# Altium project YYB.PrjPcb
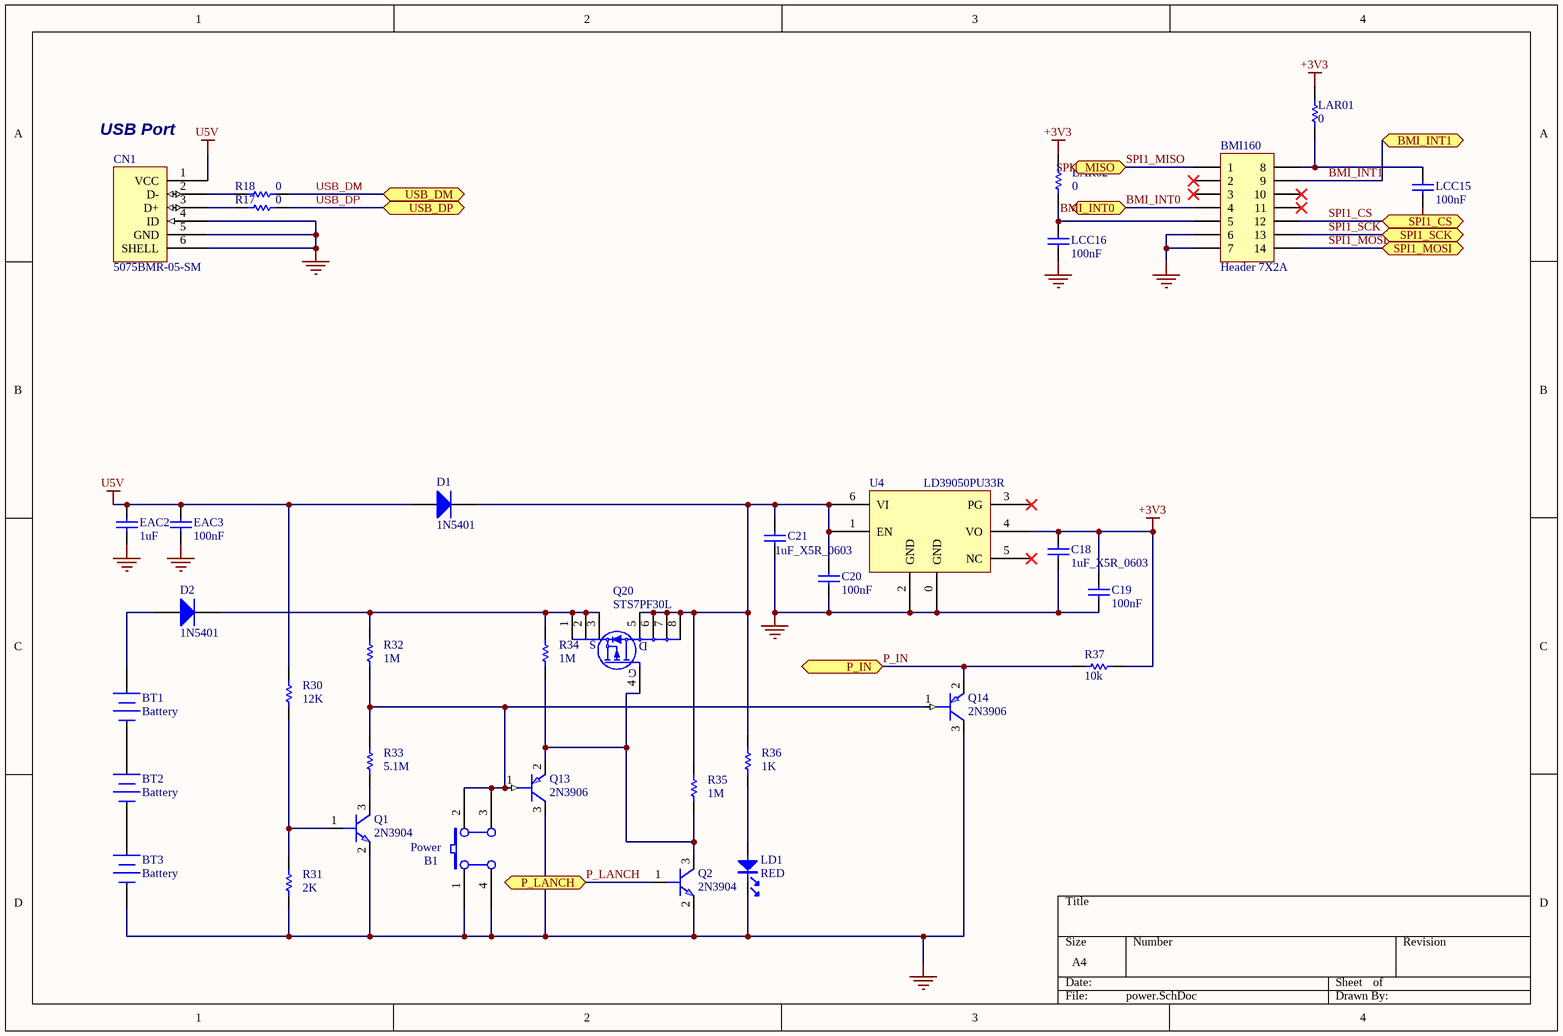
[diagram p0: power.SchDoc]
3 sheets, 145 parts. Net scope: flat (ports and power ports of the same name join across sheets).
Board file: YYB.PcbDoc
Sheets:
  power.SchDoc
  Leds.SchDoc
  MCU_64.SchDoc

## Sheet power.SchDoc
size A4

### Parts
B1  Power  [PB10]
BMI160  Header 7X2A  [BMI160]
BT1  Battery  [BAT]
BT2  Battery  [BAT]
BT3  Battery  [BAT]
C18  1uF_X5R_0603  [0603C]
C19  100nF  [0603C]
C20  100nF  [0603C]
C21  1uF_X5R_0603  [0603C]
CN1  5075BMR-05-SM  [USB-MINI-B-SMD]
D1  1N5401  [SMA]
D2  1N5401  [SMA]
EAC2  1uF  [0603C]
EAC3  100nF  [0603C]
LAR01  0  [0603R]
LAR02  0  [0603R]
LCC15  100nF  [0603C]
LCC16  100nF  [0603C]
LD1  RED  [0603D]
Q1  2N3904  [SOT-23]
Q2  2N3904  [SOT-23]
Q13  2N3906  [SOT-23]
Q14  2N3906  [SOT-23]
Q20  STS7PF30L  [SO8]
R17  0  [0603R]
R18  0  [0603R]
R30  12K  [0603R]
R31  2K  [0603R]
R32  1M  [0603R]
R33  5.1M  [0603R]
R34  1M  [0603R]
R35  1M  [0603R]
R36  1K  [0603R]
R37  10k  [0603R]
U4  LD39050PU33R  [DFN6(3X3)]

### Ports
BMI_INT0 (bidir), BMI_INT1 (bidir), P_IN (bidir), P_LANCH, SPI1_CS (bidir), SPI1_MISO (bidir), SPI1_MOSI (bidir), SPI1_SCK (bidir), USB_DM (bidir), USB_DP (bidir)

### Nets
+3V3: C18.1 C19.2 LAR01.2 LAR02.2 R37.1 U4.4(VO)
GND: B1.1(A0) B1.4(A1) BMI160.6 BMI160.7 BT3.2(-) C18.2 C19.1 C20.1 C21.2 CN1.4(ID) CN1.5(GND) CN1.6(SHELL) EAC2.2 EAC3.2 LCC15.1 LCC16.1 LD1.2 Q1.2(E) Q2.2(E) Q13.3(COLLECTOR) Q14.3(COLLECTOR) R31.1 U4.0(GND) U4.2(GND)
U5V: CN1.1(VCC) D1.1(A) EAC2.1 EAC3.1 R30.2
BMI_INT0: BMI160.4 ; port BMI_INT0
BMI_INT1: BMI160.9 ; port BMI_INT1
P_IN: Q14.2(EMITTER) R37.2 ; port P_IN
P_LANCH: Q2.1(B) ; port P_LANCH
SPI1_CS: BMI160.12 ; port SPI1_CS  [project net PA4]
SPI1_MISO: BMI160.1 ; port SPI1_MISO  [project net PA6]
SPI1_MOSI: BMI160.14 ; port SPI1_MOSI  [project net PA7]
SPI1_SCK: BMI160.13 ; port SPI1_SCK  [project net PA5]
USB_DM: R18.2 ; port USB_DM  [project net PA11]
USB_DP: R17.2 ; port USB_DP  [project net PA12]
NetB1_2: B1.2(B0) B1.3(B1) Q13.1(BASE) Q14.1(BASE) R32.1 R33.2
NetBMI160_5: BMI160.5 LAR02.1 LCC16.2
NetBMI160_8: BMI160.8 LAR01.1 LCC15.2
NetBT1_1: BT1.1(+) D2.1(A)
NetBT1_2: BT1.2(-) BT2.1(+)
NetBT2_2: BT2.2(-) BT3.1(+)
NetC20_2: C20.2 C21.1 D1.2(K) Q20.5(D) Q20.6(D) Q20.7(D) Q20.8(D) R35.2 R36.2 U4.1(EN) U4.6(VI)
NetCN1_2: CN1.2(D-) R18.1
NetCN1_3: CN1.3(D+) R17.1
NetD2_2: D2.2(K) Q20.1(S) Q20.2(S) Q20.3(S) R32.2 R34.2
NetLD1_1: LD1.1 R36.1
NetQ1_1: Q1.1(B) R30.1 R31.2
NetQ1_3: Q1.3(C) R33.1
NetQ2_3: Q2.3(C) Q13.2(EMITTER) Q20.4(G) R34.1 R35.1

Not connected (* = marked no-connect by the designer): BMI160 2* 3* 10* 11*; U4 3(PG)* 5(NC)*

### Notes on the sheet
- (near CN1) USB Port

### Library data of the parts
B1 = SW PUSHBUTTON: SE PUSHBUTTON
BMI160 = Header 7X2A: Header, 7-Pin, Dual row; LatestRevisionDate: 17-Jul-2002; LatestRevisionNote: Re-released for DXP Platform.; Publisher: Altium Limited
BT1-BT3 = Battery: Multicell Battery; Published: 24-Mar-1999; LatestRevisionDate: 17-Jul-2002; LatestRevisionNote: Re-released for DXP Platform.; PackageReference: BAT-2; Publisher: Altium Limited; PackageDescription: Battery; 2 Leads
C18 C21 = CAP SMD 0603  X5R 1礔 25V 10%: 0603  X5R 1礔; Rated voltage: 25V; Tolerance: 10%; Manufacturer: *; Manufacturer P/N: *; Order code Farnell: 1288202RL; Value: 1礔; Power: *; Technology: X5R; Temperature  Factor: *; Temperature Max: +125癈; Temperature Min: -55癈; STS Code: *
C19 C20 = Capacitor_ST: Capacitor 0402 / 0603 / 0805; Revision: July-2002: Re-released for DXP Platform.; Value: 100nF
CN1 = USB-MINI-typeB connector: Manuf_Part_1: 5075BMR-05-SM; Order: 5075BMR-05-SM; ECCN: ????
D1 D2 = STPS2L30A: Manuf_1: STM; Provided: ST; Order: BAT60JFILM; ECCN_US/EU: EAR99/NEC; Revision: July-2002: Re-released for DXP Platform.; Manuf_Part_1: BAT60JFILM; Distrib: ST
EAC2 EAC3 LCC15 LCC16 = CAP: Capacitor; Value: 100pF; Published: 8-Jun-2000; Revision: July-2002: Re-released for DXP Platform.; Publisher: Altium Limited
LAR01 LAR02 = res1: Resistor; Value: 1K; Published: 8-Jun-2000; Revision: July-2002: Re-released for DXP Platform.; Publisher: Altium Limited
LD1 = PHOTO
Q1 Q2 = 2N5551: Text Field1: 20; Text Field2: 20
Q13 Q14 = 2N5401: Text Field1: 20; Text Field2: 20
R17 R18 R30-R36 = Resistor_ST: Resistor 0402 / 0603 / 0805; Value: 10K
R37 = Resistor_ST: Resistor 0402 / 0603 / 0805; Value: 10K
U4 = LD39050P

## Sheet Leds.SchDoc: Extension connectors
size A4; DocumentNumber: MB1136; Revision: C.3; SheetNumber: 4; SheetTotal: 4; Project: NUCLEO-XXXXRX
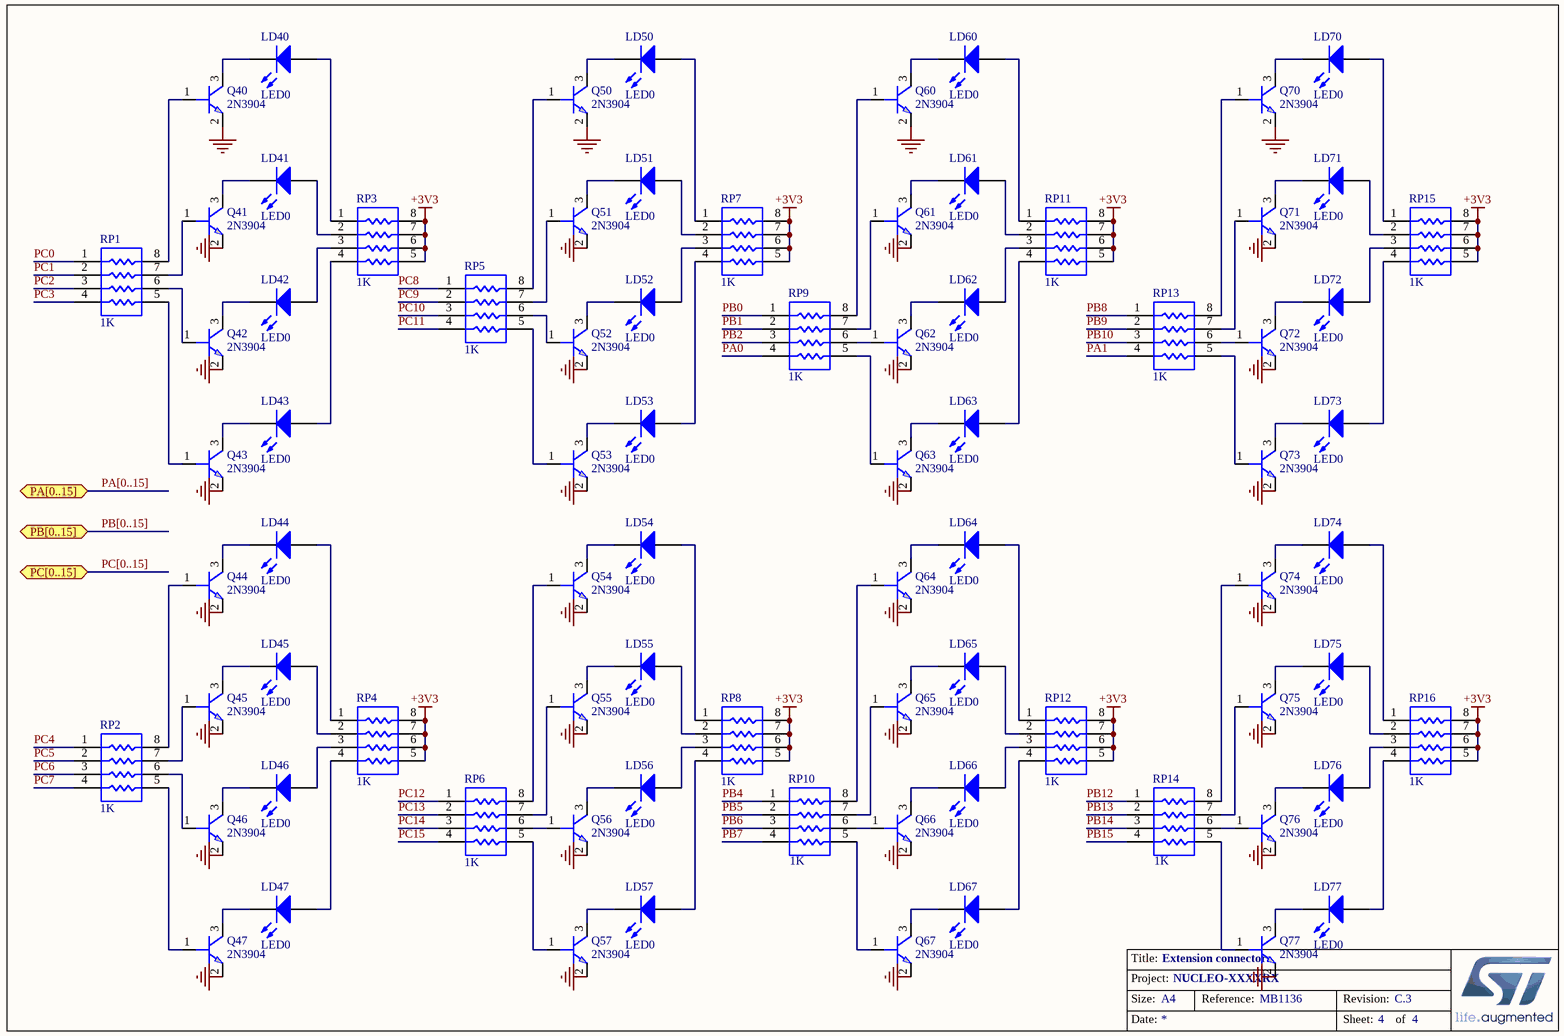
[diagram p1: Leds.SchDoc]

### Parts
LD40  LED0  [LED5]
LD41  LED0  [LED5]
LD42  LED0  [LED5]
LD43  LED0  [LED5]
LD44  LED0  [LED5]
LD45  LED0  [LED5]
LD46  LED0  [LED5]
LD47  LED0  [LED5]
LD50  LED0  [LED5]
LD51  LED0  [LED5]
LD52  LED0  [LED5]
LD53  LED0  [LED5]
LD54  LED0  [LED5]
LD55  LED0  [LED5]
LD56  LED0  [LED5]
LD57  LED0  [LED5]
LD60  LED0  [LED5]
LD61  LED0  [LED5]
LD62  LED0  [LED5]
LD63  LED0  [LED5]
LD64  LED0  [LED5]
LD65  LED0  [LED5]
LD66  LED0  [LED5]
LD67  LED0  [LED5]
LD70  LED0  [LED5]
LD71  LED0  [LED5]
LD72  LED0  [LED5]
LD73  LED0  [LED5]
LD74  LED0  [LED5]
LD75  LED0  [LED5]
LD76  LED0  [LED5]
LD77  LED0  [LED5]
Q40  2N3904  [SOT-23]
Q41  2N3904  [SOT-23]
Q42  2N3904  [SOT-23]
Q43  2N3904  [SOT-23]
Q44  2N3904  [SOT-23]
Q45  2N3904  [SOT-23]
Q46  2N3904  [SOT-23]
Q47  2N3904  [SOT-23]
Q50  2N3904  [SOT-23]
Q51  2N3904  [SOT-23]
Q52  2N3904  [SOT-23]
Q53  2N3904  [SOT-23]
Q54  2N3904  [SOT-23]
Q55  2N3904  [SOT-23]
Q56  2N3904  [SOT-23]
Q57  2N3904  [SOT-23]
Q60  2N3904  [SOT-23]
Q61  2N3904  [SOT-23]
Q62  2N3904  [SOT-23]
Q63  2N3904  [SOT-23]
Q64  2N3904  [SOT-23]
Q65  2N3904  [SOT-23]
Q66  2N3904  [SOT-23]
Q67  2N3904  [SOT-23]
Q70  2N3904  [SOT-23]
Q71  2N3904  [SOT-23]
Q72  2N3904  [SOT-23]
Q73  2N3904  [SOT-23]
Q74  2N3904  [SOT-23]
Q75  2N3904  [SOT-23]
Q76  2N3904  [SOT-23]
Q77  2N3904  [SOT-23]
RP1  1K  [4P8]
RP2  1K  [4P8]
RP3  1K  [4P8]
RP4  1K  [4P8]
RP5  1K  [4P8]
RP6  1K  [4P8]
RP7  1K  [4P8]
RP8  1K  [4P8]
RP9  1K  [4P8]
RP10  1K  [4P8]
RP11  1K  [4P8]
RP12  1K  [4P8]
RP13  1K  [4P8]
RP14  1K  [4P8]
RP15  1K  [4P8]
RP16  1K  [4P8]

### Ports
PA[0..15] (bidir), PB[0..15] (bidir), PC[0..15] (bidir)

### Nets
+3V3: RP3.5 RP3.6 RP3.7 RP3.8 RP4.5 RP4.6 RP4.7 RP4.8 RP7.5 RP7.6 RP7.7 RP7.8 RP8.5 RP8.6 RP8.7 RP8.8 RP11.5 RP11.6 RP11.7 RP11.8 RP12.5 RP12.6 RP12.7 RP12.8 RP15.5 RP15.6 RP15.7 RP15.8 RP16.5 RP16.6 RP16.7 RP16.8
GND: Q40.2(E) Q41.2(E) Q42.2(E) Q43.2(E) Q44.2(E) Q45.2(E) Q46.2(E) Q47.2(E) Q50.2(E) Q51.2(E) Q52.2(E) Q53.2(E) Q54.2(E) Q55.2(E) Q56.2(E) Q57.2(E) Q60.2(E) Q61.2(E) Q62.2(E) Q63.2(E) Q64.2(E) Q65.2(E) Q66.2(E) Q67.2(E) Q70.2(E) Q71.2(E) Q72.2(E) Q73.2(E) Q74.2(E) Q75.2(E) Q76.2(E) Q77.2(E)
PA0: RP9.4
PA1: RP13.4
PB0: RP9.1
PB1: RP9.2
PB2: RP9.3
PB4: RP10.1
PB5: RP10.2
PB6: RP10.3
PB7: RP10.4
PB8: RP13.1
PB9: RP13.2
PB10: RP13.3
PB12: RP14.1
PB13: RP14.2
PB14: RP14.3
PB15: RP14.4
PC0: RP1.1
PC1: RP1.2
PC2: RP1.3
PC3: RP1.4
PC4: RP2.1
PC5: RP2.2
PC6: RP2.3
PC7: RP2.4
PC8: RP5.1
PC9: RP5.2
PC10: RP5.3
PC11: RP5.4
PC12: RP6.1
PC13: RP6.2
PC14: RP6.3
PC15: RP6.4
NetLD40_1: LD40.1(A) RP3.1
NetLD40_2: LD40.2(K) Q40.3(C)
NetLD41_1: LD41.1(A) RP3.2
NetLD41_2: LD41.2(K) Q41.3(C)
NetLD42_1: LD42.1(A) RP3.3
NetLD42_2: LD42.2(K) Q42.3(C)
NetLD43_1: LD43.1(A) RP3.4
NetLD43_2: LD43.2(K) Q43.3(C)
NetLD44_1: LD44.1(A) RP4.1
NetLD44_2: LD44.2(K) Q44.3(C)
NetLD45_1: LD45.1(A) RP4.2
NetLD45_2: LD45.2(K) Q45.3(C)
NetLD46_1: LD46.1(A) RP4.3
NetLD46_2: LD46.2(K) Q46.3(C)
NetLD47_1: LD47.1(A) RP4.4
NetLD47_2: LD47.2(K) Q47.3(C)
NetLD50_1: LD50.1(A) RP7.1
NetLD50_2: LD50.2(K) Q50.3(C)
NetLD51_1: LD51.1(A) RP7.2
NetLD51_2: LD51.2(K) Q51.3(C)
NetLD52_1: LD52.1(A) RP7.3
NetLD52_2: LD52.2(K) Q52.3(C)
NetLD53_1: LD53.1(A) RP7.4
NetLD53_2: LD53.2(K) Q53.3(C)
NetLD54_1: LD54.1(A) RP8.1
NetLD54_2: LD54.2(K) Q54.3(C)
NetLD55_1: LD55.1(A) RP8.2
NetLD55_2: LD55.2(K) Q55.3(C)
NetLD56_1: LD56.1(A) RP8.3
NetLD56_2: LD56.2(K) Q56.3(C)
NetLD57_1: LD57.1(A) RP8.4
NetLD57_2: LD57.2(K) Q57.3(C)
NetLD60_1: LD60.1(A) RP11.1
NetLD60_2: LD60.2(K) Q60.3(C)
NetLD61_1: LD61.1(A) RP11.2
NetLD61_2: LD61.2(K) Q61.3(C)
NetLD62_1: LD62.1(A) RP11.3
NetLD62_2: LD62.2(K) Q62.3(C)
NetLD63_1: LD63.1(A) RP11.4
NetLD63_2: LD63.2(K) Q63.3(C)
NetLD64_1: LD64.1(A) RP12.1
NetLD64_2: LD64.2(K) Q64.3(C)
NetLD65_1: LD65.1(A) RP12.2
NetLD65_2: LD65.2(K) Q65.3(C)
NetLD66_1: LD66.1(A) RP12.3
NetLD66_2: LD66.2(K) Q66.3(C)
NetLD67_1: LD67.1(A) RP12.4
NetLD67_2: LD67.2(K) Q67.3(C)
NetLD70_1: LD70.1(A) RP15.1
NetLD70_2: LD70.2(K) Q70.3(C)
NetLD71_1: LD71.1(A) RP15.2
NetLD71_2: LD71.2(K) Q71.3(C)
NetLD72_1: LD72.1(A) RP15.3
NetLD72_2: LD72.2(K) Q72.3(C)
NetLD73_1: LD73.1(A) RP15.4
NetLD73_2: LD73.2(K) Q73.3(C)
NetLD74_1: LD74.1(A) RP16.1
NetLD74_2: LD74.2(K) Q74.3(C)
NetLD75_1: LD75.1(A) RP16.2
NetLD75_2: LD75.2(K) Q75.3(C)
NetLD76_1: LD76.1(A) RP16.3
NetLD76_2: LD76.2(K) Q76.3(C)
NetLD77_1: LD77.1(A) RP16.4
NetLD77_2: LD77.2(K) Q77.3(C)
NetQ40_1: Q40.1(B) RP1.8
NetQ41_1: Q41.1(B) RP1.7
NetQ42_1: Q42.1(B) RP1.6
NetQ43_1: Q43.1(B) RP1.5
NetQ44_1: Q44.1(B) RP2.8
NetQ45_1: Q45.1(B) RP2.7
NetQ46_1: Q46.1(B) RP2.6
NetQ47_1: Q47.1(B) RP2.5
NetQ50_1: Q50.1(B) RP5.8
NetQ51_1: Q51.1(B) RP5.7
NetQ52_1: Q52.1(B) RP5.6
NetQ53_1: Q53.1(B) RP5.5
NetQ54_1: Q54.1(B) RP6.8
NetQ55_1: Q55.1(B) RP6.7
NetQ56_1: Q56.1(B) RP6.6
NetQ57_1: Q57.1(B) RP6.5
NetQ60_1: Q60.1(B) RP9.8
NetQ61_1: Q61.1(B) RP9.7
NetQ62_1: Q62.1(B) RP9.6
NetQ63_1: Q63.1(B) RP9.5
NetQ64_1: Q64.1(B) RP10.8
NetQ65_1: Q65.1(B) RP10.7
NetQ66_1: Q66.1(B) RP10.6
NetQ67_1: Q67.1(B) RP10.5
NetQ70_1: Q70.1(B) RP13.8
NetQ71_1: Q71.1(B) RP13.7
NetQ72_1: Q72.1(B) RP13.6
NetQ73_1: Q73.1(B) RP13.5
NetQ74_1: Q74.1(B) RP14.8
NetQ75_1: Q75.1(B) RP14.7
NetQ76_1: Q76.1(B) RP14.6
NetQ77_1: Q77.1(B) RP14.5

### Buses and harness runs
bus PA[0..15] = port PA[0..15]
bus PB[0..15] = port PB[0..15]
bus PC[0..15] = port PC[0..15]

### Notes on the sheet
- Title:
- Project:
- Size:
- Date:
- A4
- Reference:
- Sheet:
- Revision:
- of

### Library data of the parts
LD40-LD47 LD50-LD57 LD60-LD67 LD70-LD77 = LED0: Typical INFRARED GaAs LED; Published: 8-Jun-2000; LatestRevisionDate: 08-Jul-2005; LatestRevisionNote: Mech Layer 1 removed.; PackageReference: LED-0; Publisher: Altium Limited; PackageDescription: LED; 2 Leads
Q40-Q47 Q50-Q57 Q60-Q67 Q70-Q77 = 2N5551: Text Field1: 20; Text Field2: 20
RP1-RP16 = RESPACK3_1

## Sheet MCU_64.SchDoc: MCU
size A4; DocumentNumber: MB1136; Revision: C.3; SheetNumber: 2; SheetTotal: 4; Project: NUCLEO-XXXXRX
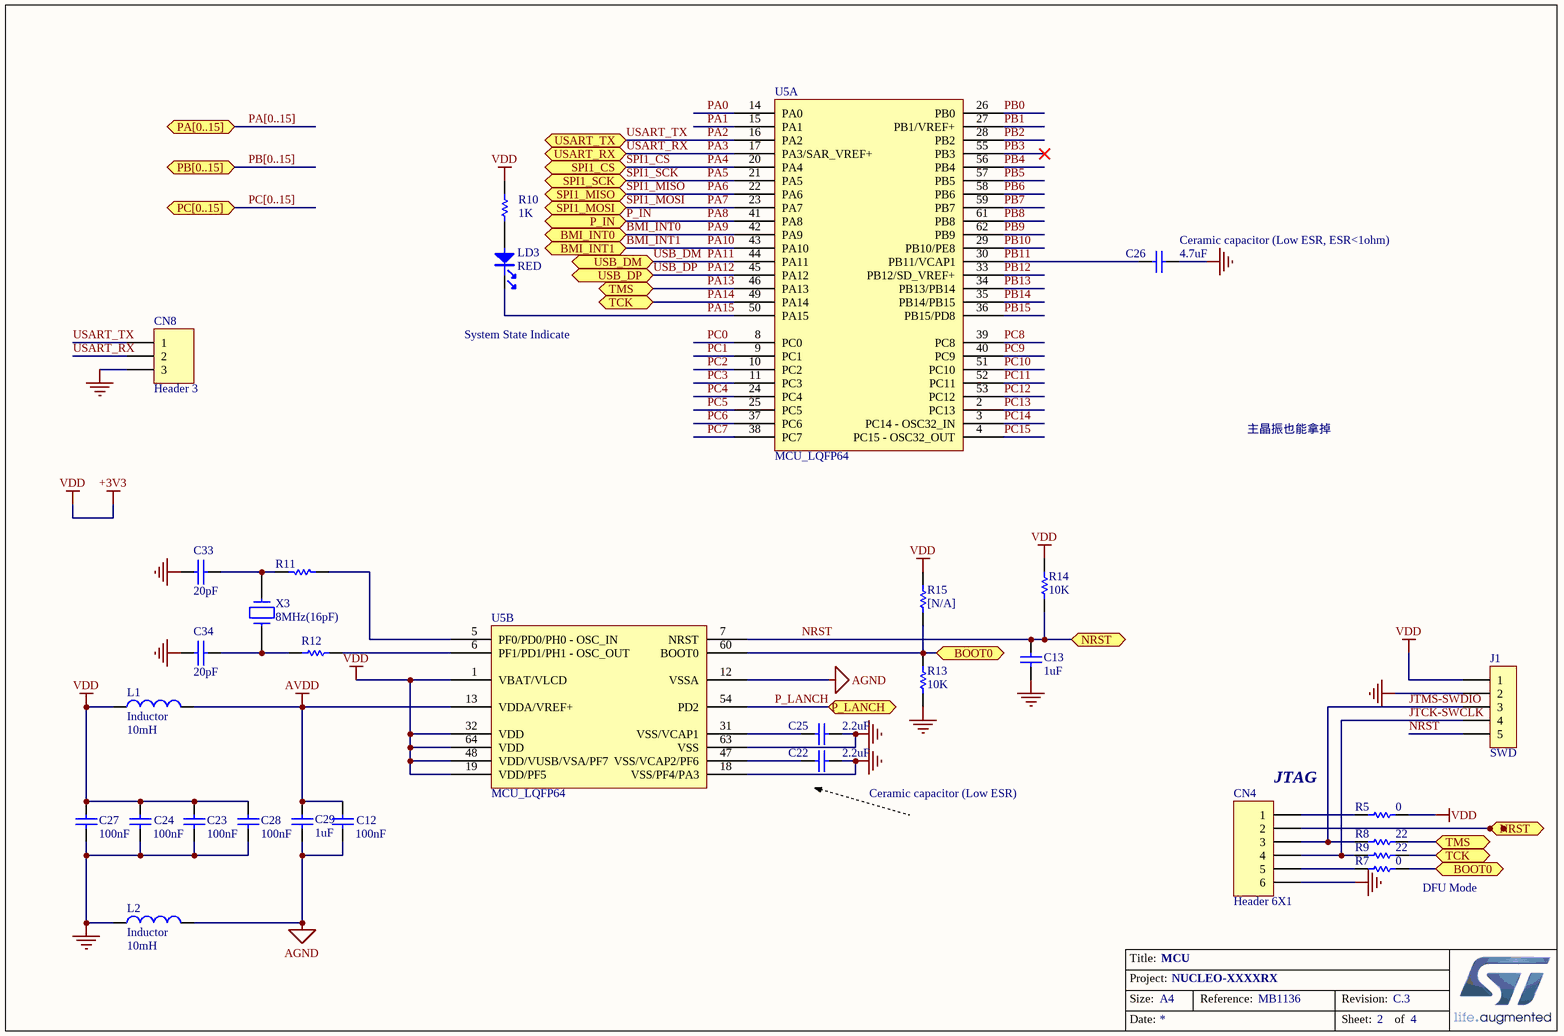
[diagram p2: MCU_64.SchDoc]

### Parts
C12  100nF  [0603C]
C13  1uF  [0603C]
C22  2.2uF  [C-0805]
C23  100nF  [0603C]
C24  100nF  [0603C]
C25  2.2uF  [C-0805]
C26  4.7uF  [C-0805]
C27  100nF  [0603C]
C28  100nF  [0603C]
C29  1uF  [0603C]
C33  20pF  [0603C]
C34  20pF  [0603C]
CN4  Header 6X1  [HDR1X6]
CN8  Header 3  [HDR1X3]
J1  SWD  [HDR1X5]
L1  Inductor  value 10mH  [0603R]
L2  Inductor  value 10mH  [0603R]
LD3  RED  [0603D]
R5  0  [0603R]
R7  0  [0603R]
R8  22  [0603R]
R9  22  [0603R]
R10  1K  [0603R]
R11  (no value)  [0603R]
R12  (no value)  [0603R]
R13  10K  [0603R]
R14  10K  [0603R]
R15  [N/A]  [0603R]
U5  MCU_LQFP64  [LQFP64]  (parts A,B of 2)
X3  8MHz(16pF)  [X-1105/A-JL]

### Ports
BMI_INT0 (bidir), BMI_INT1 (bidir), BOOT0, NRST, P_IN (bidir), P_LANCH, PA[0..15] (bidir), PB[0..15] (bidir), PC[0..15] (bidir), SPI1_CS (bidir), SPI1_MISO (bidir), SPI1_MOSI (bidir), SPI1_SCK (bidir), TCK, TMS, USART_RX (bidir), USART_TX (bidir), USB_DM (bidir), USB_DP (bidir)

### Nets
+3V3: C23.1 C24.1 C27.1 C28.1 J1.1 L1.1 R5.2 R10.2 R14.1 R15.1 U5.1(VBAT/VLCD) U5.19(VDD/PF5) U5.32(VDD) U5.48(VDD/VUSB/VSA/PF7) U5.64(VDD)  [also labelled VDD]
AGND: C12.2 C29.2 L2.2 U5.12(VSSA)
AVDD: C12.1 C29.1 L1.2 U5.13(VDDA/VREF+)
GND: C13.2 C22.2 C23.2 C24.2 C25.2 C26.2 C27.2 C28.2 C33.2 C34.2 CN4.6 CN8.3 J1.2 L2.1 R13.2 U5.18(VSS/PF4/PA3) U5.63(VSS)
BMI_INT0: U5.42(PA9) ; port BMI_INT0  [also labelled PA9]
BMI_INT1: U5.43(PA10) ; port BMI_INT1  [also labelled PA10]
JTCK-SWCLK: CN4.4 J1.4 R9.1
JTMS-SWDIO: CN4.3 J1.3 R8.1
NRST: C13.1 CN4.2 J1.5 R14.2 U5.7(NRST) ; port NRST
P_IN: U5.41(PA8) ; port P_IN  [also labelled PA8]
P_LANCH: U5.54(PD2) ; port P_LANCH
PA0: U5.14(PA0)
PA1: U5.15(PA1)
PA2: CN8.1 U5.16(PA2) ; port USART_TX  [also labelled USART_TX]
PA3: CN8.2 U5.17(PA3/SAR_VREF+) ; port USART_RX  [also labelled USART_RX]
PA4: U5.20(PA4) ; port SPI1_CS  [also labelled SPI1_CS]
PA5: U5.21(PA5) ; port SPI1_SCK  [also labelled SPI1_SCK]
PA6: U5.22(PA6) ; port SPI1_MISO  [also labelled SPI1_MISO]
PA7: U5.23(PA7) ; port SPI1_MOSI  [also labelled SPI1_MOSI]
PA11: U5.44(PA11) ; port USB_DM  [also labelled USB_DM]
PA12: U5.45(PA12) ; port USB_DP  [also labelled USB_DP]
PA13: R8.2 U5.46(PA13) ; port TMS
PA14: R9.2 U5.49(PA14) ; port TCK
PA15: LD3.2 U5.50(PA15)
PB0: U5.26(PB0)
PB1: U5.27(PB1/VREF+)
PB2: U5.28(PB2)
PB3: U5.55(PB3)
PB4: U5.56(PB4)
PB5: U5.57(PB5)
PB6: U5.58(PB6)
PB7: U5.59(PB7)
PB8: U5.61(PB8)
PB9: U5.62(PB9)
PB10: U5.29(PB10/PE8)
PB11: C26.1 U5.30(PB11/VCAP1)
PB12: U5.33(PB12/SD_VREF+)
PB13: U5.34(PB13/PB14)
PB14: U5.35(PB14/PB15)
PB15: U5.36(PB15/PD8)
PC0: U5.8(PC0)
PC1: U5.9(PC1)
PC2: U5.10(PC2)
PC3: U5.11(PC3)
PC4: U5.24(PC4)
PC5: U5.25(PC5)
PC6: U5.37(PC6)
PC7: U5.38(PC7)
PC8: U5.39(PC8)
PC9: U5.40(PC9)
PC10: U5.51(PC10)
PC11: U5.52(PC11)
PC12: U5.53(PC12)
PC13: U5.2(PC13)
PC14: U5.3(PC14_-_OSC32_IN)
PC15: U5.4(PC15_-_OSC32_OUT)
NetC22_1: C22.1 U5.47(VSS/VCAP2/PF6)
NetC25_1: C25.1 U5.31(VSS/VCAP1)
NetC33_1: C33.1 R11.2 X3.2
NetC34_1: C34.1 R12.2 X3.1
NetCN4_1: CN4.1 R5.1
NetCN4_5: CN4.5 R7.1
NetLD3_1: LD3.1 R10.1
NetR7_2: R7.2 R13.1 R15.2 U5.60(BOOT0) ; port BOOT0
NetR11_1: R11.1 U5.5(PF0/PD0/PH0_-_OSC_IN)
NetR12_1: R12.1 U5.6(PF1/PD1/PH1_-_OSC_OUT)

### Buses and harness runs
bus PA[0..15] = port PA[0..15]
bus PB[0..15] = port PB[0..15]
bus PC[0..15] = port PC[0..15]

### Notes on the sheet
- (near C26) Ceramic capacitor (Low ESR, ESR<1ohm)
- System State Indicate
- 主晶振也能拿掉
- (near CN4) JTAG
- Ceramic capacitor (Low ESR)
- DFU Mode
- Title:
- Project:
- Size:
- Date:
- A4
- Reference:
- Sheet:
- Revision:
- of

### Library data of the parts
C12 C23 C24 C27 C28 = Cap: Capacitor; Value: 10nF; Published: 8-Jun-2000; Revision: July-2002: Re-released for DXP Platform.; Publisher: Altium Limited
C13 C29 = CAP SMD 0603  X5R 1礔 25V 10%: as C18 on sheet power; Manufacturer: *; Manufacturer P/N: *; Order code Farnell: 1288202RL; Value: 1礔; Power: *; Technology: X5R; Temperature  Factor: *; Temperature Max: +125癈; Temperature Min: -55癈; STS Code: *
C22 C25 = Cap_2.2uF_X7R_10%_0805: Capacitor,2.2uF,16V, X7R,10%,0805,YAGEO; Manuf_Part_1: CC0805KKX7R7BB225; Revision: July-2002: Re-released for DXP Platform.; Value: 2.2uF; Order: CC0805KKX7R7BB225; Manuf_1: YAGEO
C26 = Cap_2.2uF_X7R_10%_0805: Capacitor,4.7uF,25V, X7R,10%,1206,YAGEO; Manuf_Part_1: CC0805KKX7R7BB225; Value: 2.2uF; Revision: July-2002: Re-released for DXP Platform.; Order: CC0805KKX7R7BB225; Manuf_1: YAGEO
C33 C34 = CAP: Capacitor
CN4 = Header 6: Header, 6-Pin; LatestRevisionDate: 17-Jul-2002; LatestRevisionNote: Re-released for DXP Platform.; Publisher: Altium Limited
CN8 = Header 3: Header, 3-Pin; LatestRevisionDate: 17-Jul-2002; LatestRevisionNote: Re-released for DXP Platform.; Publisher: Altium Limited
J1 = CON5: Connector
L1 L2 = Inductor: Code_IEC: 1005; Published: 8-Jun-2000; LatestRevisionDate: 29-May-2009; LatestRevisionNote: IPC-7351 Footprint Added.; PackageReference: 0402-A; Publisher: Altium Limited; PackageDescription: Chip Inductor; Code_JEITA: 0402
LD3 = PHOTO
R5 R7-R10 = Resistor_ST: Resistor 0402 / 0603 / 0805; Value: 10K
R11 R12 = Res1: Resistor; Value: 1K; Published: 8-Jun-2000; Revision: July-2002: Re-released for DXP Platform.; Publisher: Altium Limited
R13-R15 = res1: Resistor; Value: 1K; Published: 8-Jun-2000; Revision: July-2002: Re-released for DXP Platform.; Publisher: Altium Limited
X3 = CRYSTAL

## Nets that join several sheets
+3V3: power (6 pins), Leds (32 pins), MCU_64 (15 pins)
GND: power (24 pins), Leds (32 pins), MCU_64 (17 pins)
BMI_INT0: power (BMI160.4), MCU_64 (U5.42)
BMI_INT1: power (BMI160.9), MCU_64 (U5.43)
P_IN: power (Q14.2 R37.2), MCU_64 (U5.41)
P_LANCH: power (Q2.1), MCU_64 (U5.54)
PA0: Leds (RP9.4), MCU_64 (U5.14)
PA1: Leds (RP13.4), MCU_64 (U5.15)
PA4: power (BMI160.12), MCU_64 (U5.20)
PA5: power (BMI160.13), MCU_64 (U5.21)
PA6: power (BMI160.1), MCU_64 (U5.22)
PA7: power (BMI160.14), MCU_64 (U5.23)
PA11: power (R18.2), MCU_64 (U5.44)
PA12: power (R17.2), MCU_64 (U5.45)
PB0: Leds (RP9.1), MCU_64 (U5.26)
PB1: Leds (RP9.2), MCU_64 (U5.27)
PB2: Leds (RP9.3), MCU_64 (U5.28)
PB4: Leds (RP10.1), MCU_64 (U5.56)
PB5: Leds (RP10.2), MCU_64 (U5.57)
PB6: Leds (RP10.3), MCU_64 (U5.58)
PB7: Leds (RP10.4), MCU_64 (U5.59)
PB8: Leds (RP13.1), MCU_64 (U5.61)
PB9: Leds (RP13.2), MCU_64 (U5.62)
PB10: Leds (RP13.3), MCU_64 (U5.29)
PB12: Leds (RP14.1), MCU_64 (U5.33)
PB13: Leds (RP14.2), MCU_64 (U5.34)
PB14: Leds (RP14.3), MCU_64 (U5.35)
PB15: Leds (RP14.4), MCU_64 (U5.36)
PC0: Leds (RP1.1), MCU_64 (U5.8)
PC1: Leds (RP1.2), MCU_64 (U5.9)
PC2: Leds (RP1.3), MCU_64 (U5.10)
PC3: Leds (RP1.4), MCU_64 (U5.11)
PC4: Leds (RP2.1), MCU_64 (U5.24)
PC5: Leds (RP2.2), MCU_64 (U5.25)
PC6: Leds (RP2.3), MCU_64 (U5.37)
PC7: Leds (RP2.4), MCU_64 (U5.38)
PC8: Leds (RP5.1), MCU_64 (U5.39)
PC9: Leds (RP5.2), MCU_64 (U5.40)
PC10: Leds (RP5.3), MCU_64 (U5.51)
PC11: Leds (RP5.4), MCU_64 (U5.52)
PC12: Leds (RP6.1), MCU_64 (U5.53)
PC13: Leds (RP6.2), MCU_64 (U5.2)
PC14: Leds (RP6.3), MCU_64 (U5.3)
PC15: Leds (RP6.4), MCU_64 (U5.4)